# Altium schematic sheet FM_Module.SchDoc
size A4; Organization: Altium Limited; Address1: L3, 12a Rodborough Rd; Address2: Frenchs Forest; Address3: NSW; Address4: Australia 2086; Stage: DRAFT
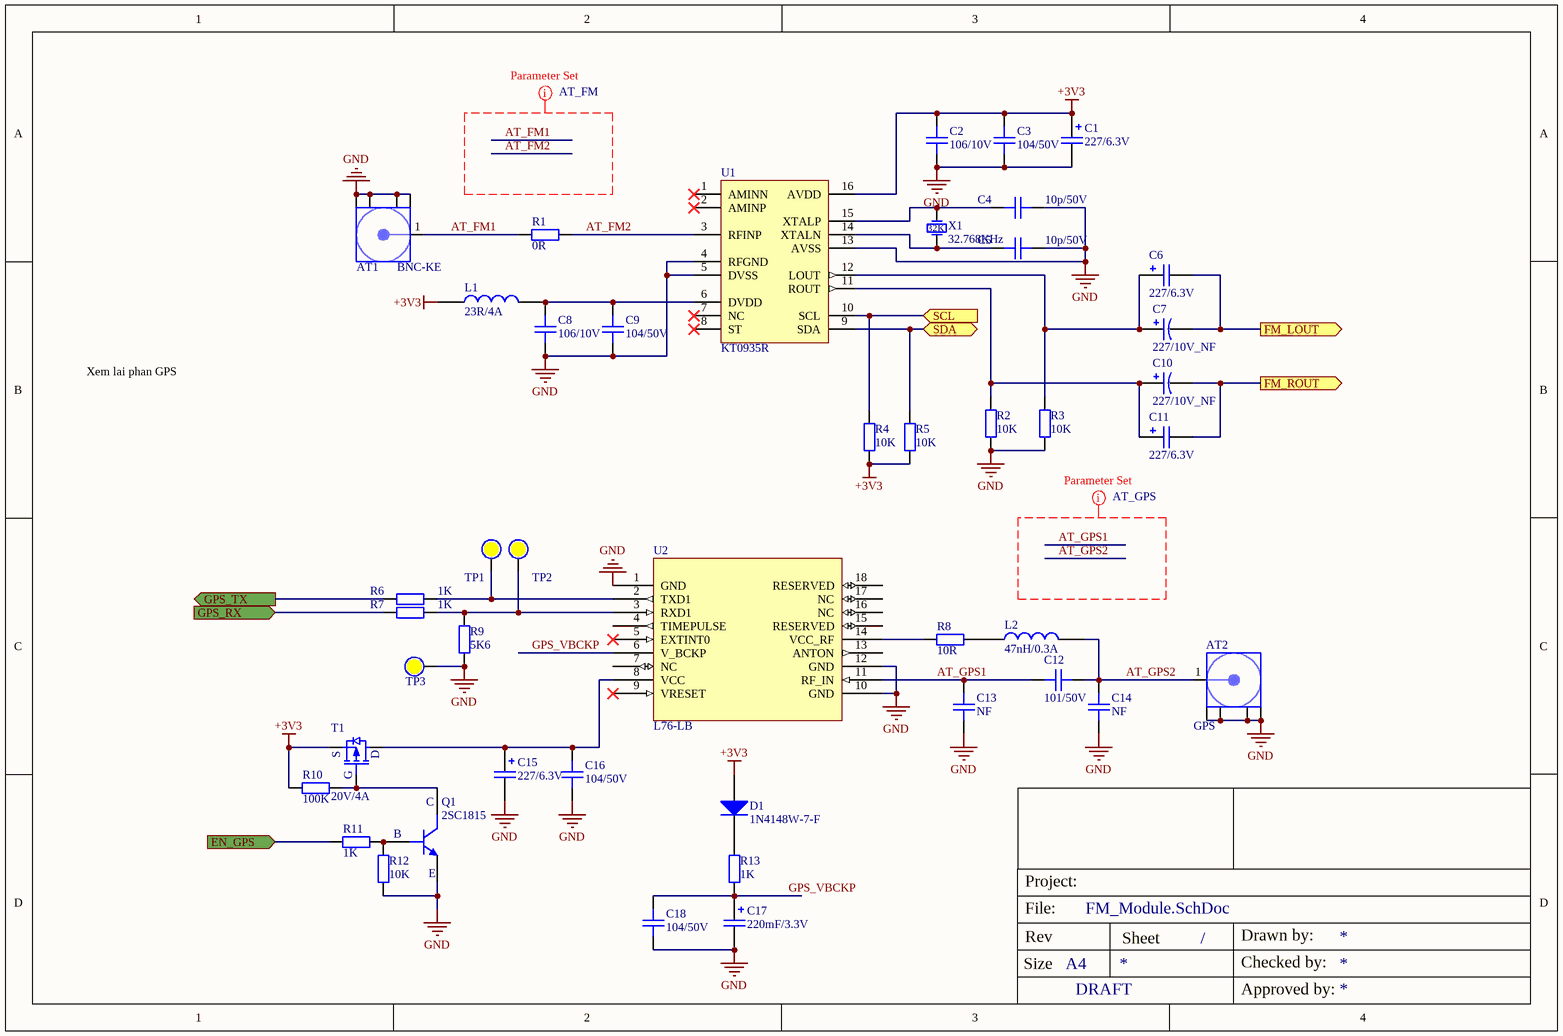
[diagram p0: FM_Module.SchDoc]

## Parts
AT1  BNC-KE  [BNC-KE]
AT2  GPS  [SMA-KE-20]
C1  227/6.3V  [CAP_TANTAL_1210(3528)]
C2  106/10V  [CAPC-0603 (1608) - HD]
C3  104/50V  [CAPC-0603 (1608) - HD]
C4  10p/50V  [CAPC-0603 (1608) - HD]
C5  10p/50V  [CAPC-0603 (1608) - HD]
C6  227/6.3V  [CAP_TANTAL_1210(3528)]
C7  227/10V_NF  [CAP_ALUM_D5.0_S2.0]
C8  106/10V  [CAPC-0603 (1608) - HD]
C9  104/50V  [CAPC-0603 (1608) - HD]
C10  227/10V_NF  [CAP_ALUM_D5.0_S2.0]
C11  227/6.3V  [CAP_TANTAL_1210(3528)]
C12  101/50V  [CAPC-0603 (1608) - HD]
C13  NF  [CAPC-0603 (1608) - HD]
C14  NF  [CAPC-0603 (1608) - HD]
C15  227/6.3V  [CAP_TANTAL_1210(3528)]
C16  104/50V  [CAPC-0603 (1608) - HD]
C17  220mF/3.3V  [CAP-SUPER-0.22F]
C18  104/50V  [CAPC-0603 (1608) - HD]
D1  1N4148W-7-F  [SOD-123]
L1  23R/4A  [IND-0603 (1608) - HD]
L2  47nH/0.3A  [IND-0603 (1608) - HD]
Q1  2SC1815  [SOT23_3]
R1  0R  [RESC-0603 (1608) - HD]
R2  10K  [RESC-0603 (1608) - HD]
R3  10K  [RESC-0603 (1608) - HD]
R4  10K  [RESC-0603 (1608) - HD]
R5  10K  [RESC-0603 (1608) - HD]
R6  1K  [RESC-0603 (1608) - HD]
R7  1K  [RESC-0603 (1608) - HD]
R8  10R  [RESC-0603 (1608) - HD]
R9  5K6  [RESC-0603 (1608) - HD]
R10  100K  [RESC-0603 (1608) - HD]
R11  1K  [RESC-0603 (1608) - HD]
R12  10K  [RESC-0603 (1608) - HD]
R13  1K  [RESC-0603 (1608) - HD]
T1  20V/4A  [SOT23_3]
TP1  (no value)  [Test Point 1 Side]  (no BOM)
TP2  (no value)  [Test Point 1 Side]  (no BOM)
TP3  (no value)  [Test Point 1 Side]  (no BOM)
U1  KT0935R  [KT0935R]
U2  L76-LB  [GPS.L7x]
X1  32.768KHz  [CRYSTAL_ABS06 2x1.2mm]

## Ports
EN_GPS (in), FM_LOUT (out), FM_ROUT (out), GPS_RX (in), GPS_TX (out), SCL (in), SDA (bidir)

## Nets
+3V3: C1.1 C2.2 C3.2 D1.1(A) L1.1 R4.1 R5.1 R10.1 T1.2(S) U1.16(AVDD)
GND: AT1.2 AT2.2 C1.2 C2.1 C3.1 C4.2 C5.2 C8.1 C9.1 C13.1 C14.1 C15.2 C16.1 C17.2 C18.1 Q1.2(E) R2.1 R3.1 R9.1 R12.1 TP3.0 U1.4(RFGND) U1.5(DVSS) U1.13(AVSS) U2.1(GND) U2.10(GND) U2.12(GND)
AT_FM1: AT1.1(Signal) R1.1
AT_FM2: R1.2 U1.3(RFINP)
AT_GPS1: C12.1 C13.2 U2.11(RF_IN)
AT_GPS2: AT2.1(Signal) C12.2 C14.2 L2.2
EN_GPS: R11.1 ; port EN_GPS
FM_LOUT: C6.2 C7.2 ; port FM_LOUT
FM_ROUT: C10.2 C11.2 ; port FM_ROUT
GPS_RX: R7.1 ; port GPS_RX
GPS_TX: R6.1 ; port GPS_TX
GPS_VBCKP: C17.1 C18.2 R13.1 U2.6(V_BCKP)
SCL: R4.2 U1.10(SCL) ; port SCL
SDA: R5.2 U1.9(SDA) ; port SDA
NetC4_1: C4.1 U1.15(XTALP) X1.1(OSC1)
NetC5_1: C5.1 U1.14(XTALN) X1.2(OSC2)
NetC6_1: C6.1 C7.1 R3.2 U1.12(LOUT)
NetC8_2: C8.2 C9.2 L1.2 U1.6(DVDD)
NetC10_1: C10.1 C11.1 R2.2 U1.11(ROUT)
NetC15_1: C15.1 C16.2 T1.3(D) U2.8(VCC)
NetD1_2: D1.2(K) R13.2
NetL2_1: L2.1 R8.2
NetQ1_1: Q1.1(B) R11.2 R12.2
NetQ1_3: Q1.3(C) R10.2 T1.1(G)
NetR6_2: R6.2 TP1.0 U2.2(TXD1)
NetR7_2: R7.2 R9.2 TP2.0 U2.3(RXD1)
NetR8_1: R8.1 U2.14(VCC_RF)

Not connected (* = marked no-connect by the designer): U1 1(AMINN)* 2(AMINP)* 7(NC)* 8(ST)*; U2 4(TIMEPULSE) 5(EXTINT0)* 7(NC) 9(VRESET)* 13(ANTON) 15(RESERVED) 16(NC) 17(NC) 18(RESERVED)

## Layout directives
net class AT_GPS: AT_GPS1, AT_GPS2
net class AT_FM: AT_FM1, AT_FM2

## Notes on the sheet
- Xem lai phan GPS
- Project:
- File:
- Size
- Rev
- A4
- Sheet
- /
- Drawn by:
- Checked by:
- Approved by:
- (in symbol ABS06-107-32.768kHz-T) 32K

## Library data of the parts
AT1 = BNC-KE: Solder: WAVE; MFR_URL: https://detail.tmall.com/item.htm?id=600889032311&ali_refid=a3_430620_1006:1106519694:N:bqURkf1/6XELXFWgHn0phw==:e744e300de7662eb842b86005d159f1e&ali_trackid=1_e744e300de7662eb842b86005d159f1e&spm=a230r.1.14.1&skuId=4376461827836; MPN: BNC-KE
AT2 = SMA-KE-15: Solder: WAVE; MPN: SMA-KE-20; Value: GPS
C1 C6 C11 C15 = T520B227M006ATE035: CAP TANT POLY 220uF 20% 6.3V 3528 35mOhm ESR; Solder: SMT; CompanyID: VT-00643; Value: 227/6.3V; MPN: T520B227M006ATE035; Category: CAPACITOR
C2 C8 = CL10A106KP8NNNC: CAP CER 10uF 10% 10V X5R 0603; CompanyID: VT-00984; Solder: SMT; MPN: CL10A106KP8NNNC; Value: 106/10V; Category: CAPACITOR; PinCount: 2
C3 C9 C16 C18 = C0603C104K5RACTU: CAP CER 0.1uF 50V 10% X7R 0603; CompanyID: VT-00982; Solder: SMT; MPN: C0603C104K5RACTU; Value: 104/50V; Category: CAPACITOR
  C3 C9 C16: PinCount: 2
C4 C5 = CL10C100JB8NNND: CAP CER 10pF 5% 50V NP0 0603; CompanyID: VT-00983; Solder: SMT; Value: 10p/50V; MPN: CL10C100JB8NNND; Category: CAPACITOR; PinCount: 2
C7 C10 = KM227M010D11RR0VH2FP0: 220uF 10V 5mm 11mm ±20% 2mm 1000hrs@105℃ Radial Leaded,5x11mm Aluminum Electrolytic Capacitors - Leaded ROHS; MFR: CX(Dongguan Chengxing Elec); SOLDER: WAVE; MPN: KM227M010D11RR0VH2FP0; CATEGORY: CAPPACITOR; Value: 227/10V_NF
C12 = GRM1885C1H101JA01D: CAP CER 100pF 5% 50V C0G/NP0 0603; Solder: SMT; Company ID: VT00091; MPN: GRM1885C1H101JA01D; Value: 101/50V
C13 C14 = CAPC NF 0603: CAP SMD, Not Fill, 0603; Solder: Not Fill; Value: NF; Category: CAPACITOR
C17 = DCK-3R3E224U-E: CAP 220mF SUPER -20% +80% 3.3V SMD; Solder: HAND; CompanyID: VT-00316; MPN: DCK-3R3E224U-E; value: 220mF/3.3V; Category: CAPACITOR
D1 = Diode 1N4148: Diode Standard 100V 300mA (DC) Surface Mount SOD-123; Brand: DIODES; Name: VT_DIODE_1N4148W-7-F; Part Number: 1N4148W-7-F
L1 = FBMJ1608HM230NT: IND-FERRITE BEAD 23 OHM  4A 0603 1LN; CompanyID: VT-01060; Solder: SMT; MPN: FBMJ1608HM230NT; Value: 23R/4A; Category: FERRITE BEAD; PinCount: 2
L2 = HK160847NJ-T: IND-FIXED 47nH 300mA 700 mOhm 0603; Solder: SMT; CompanyID: VT-01263; Value: 47nH/0.3A; MPN: HK160847NJ-T; Category: INDUCTOR
Q1 = 2SC1815: TRANS NPN 50V 0.15A SOT23-3; Solder: SMT; MPN: 2SC1815; Value: 2SC1815
R1 = RC0603FR-070RL: RES SMD 0.0OHM JUMPER 1/10W 0603; CompanyID: VT-00901; Solder: SMT; MPN: RC0603FR-070RL; Value: 0R; Category: RESISTOR
R2-R5 R12 = RC0603FR-0710KL: RES SMD 10K OHM 1% 1/10W 0603; CompanyID: VT-00328; Solder: SMT; MPN: RC0603FR-0710KL; Value: 10K; Category: RESISTOR
R6 R7 R11 R13 = RC0603FR-071KL: RES SMD 1 KOHM 1% 1/10W 0603; CompanyID: VT-00574; Solder: SMT; MPN: RC0603FR-071KL; Value: 1K; Category: RESISTOR
R8 = RC0603FR-0710RL: RES SMD 10 OHM 1% 1/10W 0603; CompanyID: VT-00865; Solder: SMT; MPN: RC0603FR-0710RL; Value: 10R; Category: RESISTOR
R9 = RC0603FR-075K6L: RES SMD 5.6K OHM 1% 1/10W 0603; CompanyID: VT-00869; Solder: SMT; MPN: RC0603FR-075K6L; Value: 5K6; Category: RESISTOR
R10 = RC0603FR-07100KL: RES SMD 100K OHM 1% 1/10W 0603; CompanyID: VT-00332; Solder: SMT; MPN: RC0603FR-07100KL; Value: 100K; Category: RESISTOR
T1 = AO3415: MOSFET P-CH 20V 4A SOT23; MFR: Alpha & Omega Semiconductor Inc.; Solder: SMT; Value: 20V/4A; MPN: AO3415
TP1-TP3 = Test Point: Solder: NF
U1 = KT0935R: RF RX AM/FM RECEIVER; Solder: SMT; Value: KT0935R; MPN: KT0935R; Category: IC
U2 = Quectel L76-LB: GPS Module L76-LB, Quectel; Solder: SMT; Value: L76-LB; MPN: L76-LB; MFR: Quectel; Category: MODULE; PinCount: 18
X1 = ABS06-107-32.768kHz-T: CRYSTAL 32.7680KHZ 4pF SMD; Solder: SMT; Company ID: VT00159; Value: 32.768KHz; MPN: ABS06-107-32.768kHz-T